# EAGLE design auxshiled1.8 (EAGLE 6.5.0)
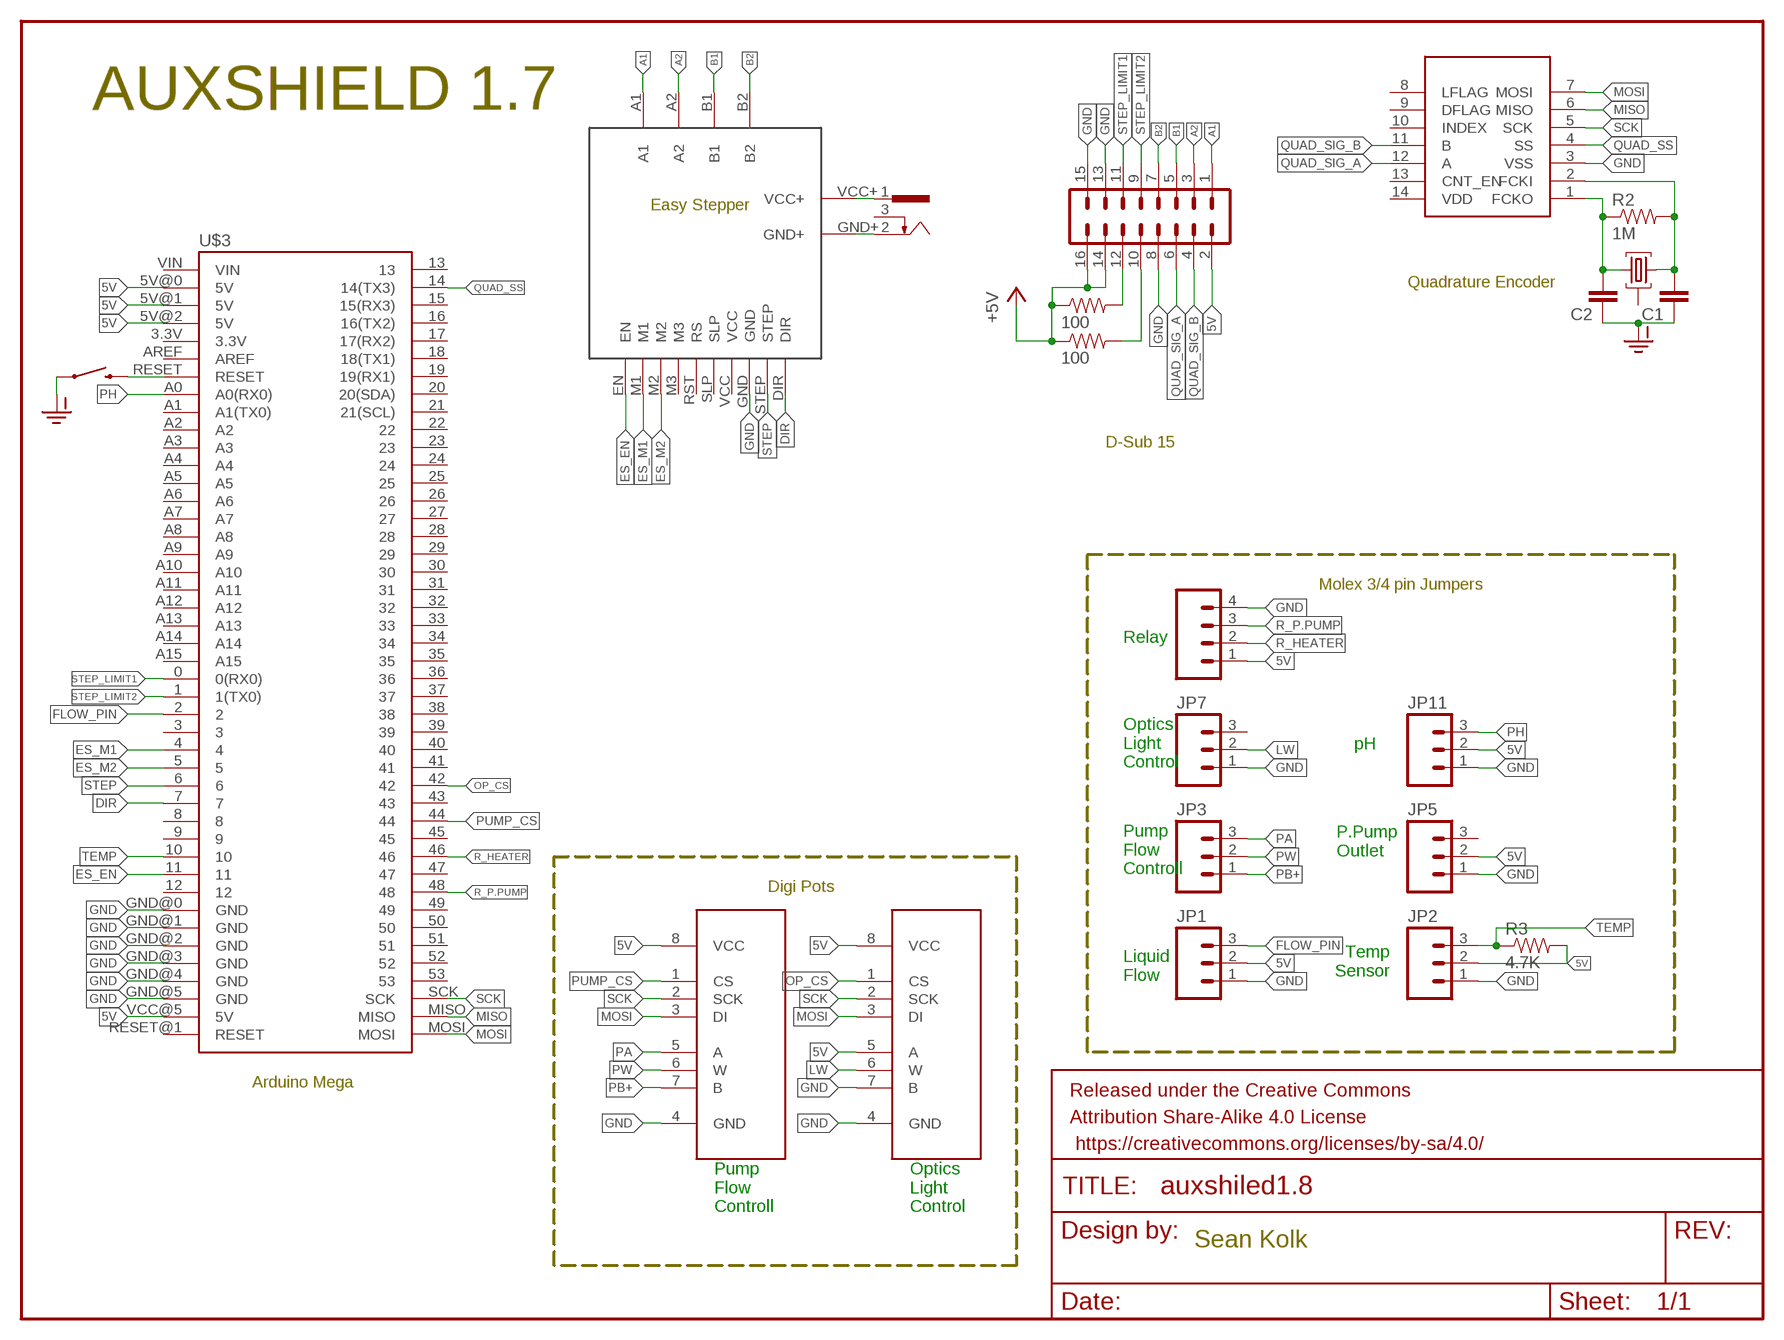
[diagram p0: schematic, sheet 1]

## Parts
C1  0.1UF-50V-20%(PTH)KIT-EZ  [CAP-PTH-SMALL-KIT]
C2  0.1UF-50V-20%(PTH)KIT-EZ  [CAP-PTH-SMALL-KIT]
FRAME1  FRAME-LETTER  [CREATIVE_COMMONS]
JP1  M03POLAR  [MOLEX-1X3]
JP2  M03POLAR  [MOLEX-1X3]
JP3  M03POLAR  [MOLEX-1X3]
JP5  M03POLAR  [MOLEX-1X3]
JP7  M03POLAR  [MOLEX-1X3]
JP11  M03POLAR  [MOLEX-1X3]
PUMPDIGIPOT  MCP41XXXDIL  [DIL-08]
QF2  14M20BHC49T  [HC49U]
R1  100  10OHM-1/4W-5%(PTH)  [AXIAL-0.3]
R2  1M  10OHM-1/4W-5%(PTH)  [AXIAL-0.3]
R3  4.7K  10OHM-1/4W-5%(PTH)  [AXIAL-0.3]
R4  100  10OHM-1/4W-5%(PTH)  [AXIAL-0.3]
RELAY  M04POLAR  [MOLEX-1X4]
S1  SWITCH-MOMENTARY-2PTH_EZ  [TACTILE-PTH-EZ]
U1  MCP41XXXDIL  [DIL-08]
U$1  M08X2  [2X8]
U$2  LS7366R  [SO014]
U$3  ARDUINO-MEGA-V2  [ARDUINO_MEGA-PRO-5V]
U$4  BIG_EASY_DRIVER  [BIG_EASY_DRIVER_PACK]
X1  SCD-014A  [SCD-014-A]

## Nets
5V: JP1.2 JP2.2 JP5.2 JP11.2 PUMPDIGIPOT.8(VCC) R1.P$1 R3.P$2 R4.P$1 RELAY.1 U1.5(A) U1.8(VCC) U$1.2 U$1.14 U$1.16 U$3.5V@0(5V) U$3.5V@1(5V) U$3.5V@2(5V) U$3.VCC@5(5V) ; supply symbol labelled +5V
A1: U$1.1 U$4.A1
A2: U$1.3 U$4.A2
B1: U$1.5 U$4.B1
B2: U$1.7 U$4.B2
DIR: U$3.7 U$4.DIR
ES_EN: U$3.11 U$4.EN
ES_M1: U$3.4 U$4.M1
ES_M2: U$3.5 U$4.M2
FLOW_PIN: JP1.3 U$3.2
GND: C1.1 C2.1 JP1.1 JP2.1 JP5.1 JP7.1 JP11.1 PUMPDIGIPOT.4(GND) RELAY.4 S1.1 U1.4(GND) U1.7(B) U$1.8 U$1.13 U$1.15 U$2.3(VSS) U$3.GND@0(GND) U$3.GND@1(GND) U$3.GND@2(GND) U$3.GND@3(GND) U$3.GND@4(GND) U$3.GND@5(GND) U$4.GND ; supply symbol labelled GND-ISO
LW: JP7.2 U1.6(W)
MISO: U$2.6(MISO) U$3.MISO
MOSI: PUMPDIGIPOT.3(DI) U1.3(DI) U$2.7(MOSI) U$3.MOSI
N$1: U$4.VCC+ X1.1
N$2: U$4.GND+ X1.2
N$4: R1.P$2 U$1.10
N$9: S1.3 U$3.RESET
N$12: C1.2 QF2.3 R2.P$2 U$2.2(FCKI)
N$25: C2.2 QF2.1 R2.P$1 U$2.1(FCKO)
N$33: R4.P$2 U$1.12
OP_CS: U1.1(CS) U$3.42
PA: JP3.3 PUMPDIGIPOT.5(A)
PB+: JP3.1 PUMPDIGIPOT.7(B)
PH: JP11.3 U$3.A0(A0(RX0))
PUMP_CS: PUMPDIGIPOT.1(CS) U$3.44
PW: JP3.2 PUMPDIGIPOT.6(W)
QUAD_SIG_A: U$1.6 U$2.12(A)
QUAD_SIG_B: U$1.4 U$2.11(B)
QUAD_SS: U$2.4(SS) U$3.14(14(TX3))
R_HEATER: RELAY.2 U$3.46
R_P.PUMP: RELAY.3 U$3.48
SCK: PUMPDIGIPOT.2(SCK) U1.2(SCK) U$2.5(SCK) U$3.SCK
STEP: U$3.6 U$4.STEP
STEP_LIMIT1: U$1.11 U$3.0(0(RX0))
STEP_LIMIT2: U$1.9 U$3.1(1(TX0))
TEMP: JP2.3 R3.P$1 U$3.10
Unconnected: JP5.3 JP7.3 QF2.2 U$2.8(LFLAG) U$2.9(DFLAG) U$2.10(INDEX) U$2.13(CNT_EN) U$2.14(VDD) U$3.3 U$3.3.3V U$3.8 U$3.9 U$3.12 U$3.13 U$3.15(15(RX3)) U$3.16(16(TX2)) U$3.17(17(RX2)) U$3.18(18(TX1)) U$3.19(19(RX1)) U$3.20(20(SDA)) U$3.21(21(SCL)) U$3.22 U$3.23 U$3.24 U$3.25 U$3.26 U$3.27 U$3.28 U$3.29 U$3.30 U$3.31 U$3.32 U$3.33 U$3.34 U$3.35 U$3.36 U$3.37 U$3.38 U$3.39 U$3.40 U$3.41 U$3.43 U$3.45 U$3.47 U$3.49 U$3.50 U$3.51 U$3.52 U$3.53 U$3.A1(A1(TX0)) U$3.A2 U$3.A3 U$3.A4 U$3.A5 U$3.A6 U$3.A7 U$3.A8 U$3.A9 U$3.A10 U$3.A11 U$3.A12 U$3.A13 U$3.A14 U$3.A15 U$3.AREF U$3.RESET@1(RESET) U$3.VIN U$4.M3 U$4.RST(RS) U$4.SLP U$4.VCC X1.3

## Notes on the sheet
- AUXSHIELD 1.7
- Easy Stepper
- Quadrature Encoder
- D-Sub 15
- Molex 3/4 pin Jumpers
- Relay
- pH
- Optics
  Light 
  Control
- P.Pump 
  Outlet
- Pump
  Flow
  Controll
- Digi Pots
- Temp
  Sensor
- Liquid 
  Flow
- Arduino Mega
- Pump
  Flow
  Controll
- Optics
  Light
  Control
- Sean Kolk

## Library data of the parts
C1 C2 = SparkFun-Capacitors:0.1UF-50V-20%(PTH): CAP-08370; PROD_ID: CAP-08370
FRAME1 = SparkFun-Aesthetics:FRAME-LETTER: Schematic Frame Standard 8.5x11 US Letter frame
JP1-JP3 JP5 JP7 JP11 = SparkFun-Connectors:M03: Header 3 Standard 3-pin 0.1" header. Use with straight break away headers (SKU : PRT-00116), right angle break away headers (PRT-00553), swiss pins (PRT-00743), machine pins (PRT-00117), and female headers (PRT-00115). Molex polarized connector foot print use with SKU : PRT-08232 with associated crimp pins and housings.
PUMPDIGIPOT U1 = SparkFun-AnalogIC:MCP41XXX: SPI controlled single digital potentiometer by Microchip PID: COM-10613
QF2 = crystal:14M20BHC49T: Monolithic Crystal Filters Source: www.vanlong.com; OC_FARNELL: unknown; OC_NEWARK: unknown
R1-R4 = SparkFun-Resistors:10OHM-1/4W-5%(PTH): RES-10698; PROD_ID: RES-10698; VALUE: 10
RELAY = SparkFun-Connectors:M04: Header 4 Standard 4-pin 0.1" header. Use with straight break away headers (SKU : PRT-00116), right angle break away headers (PRT-00553), swiss pins (PRT-00743), machine pins (PRT-00117), and female headers (PRT-00115). Molex polarized connector foot print use with SKU : PRT-08231 with associated crimp pins and housings. 1MM SMD Version SKU: PRT-10208
S1 = SparkFun-Electromechanical:SWITCH-MOMENTARY-2: Various NO switches- pushbuttons, reed, etc
U$1 = SparkFun-Connectors:M08X2: .1" headers, two rows of 8 each
U$2 = SparkFun-DigitalIC:LS7366R
U$3 = MEGASHIELD2:ARDUINO-MEGA-V2
U$4 = SparkFun-Boards:BIG_EASY_DRIVER
X1 = con-shiua-chyuan:SCD-014A: Power Jack 2.5mm; OC_FARNELL: unknown; OC_NEWARK: unknown

## Board
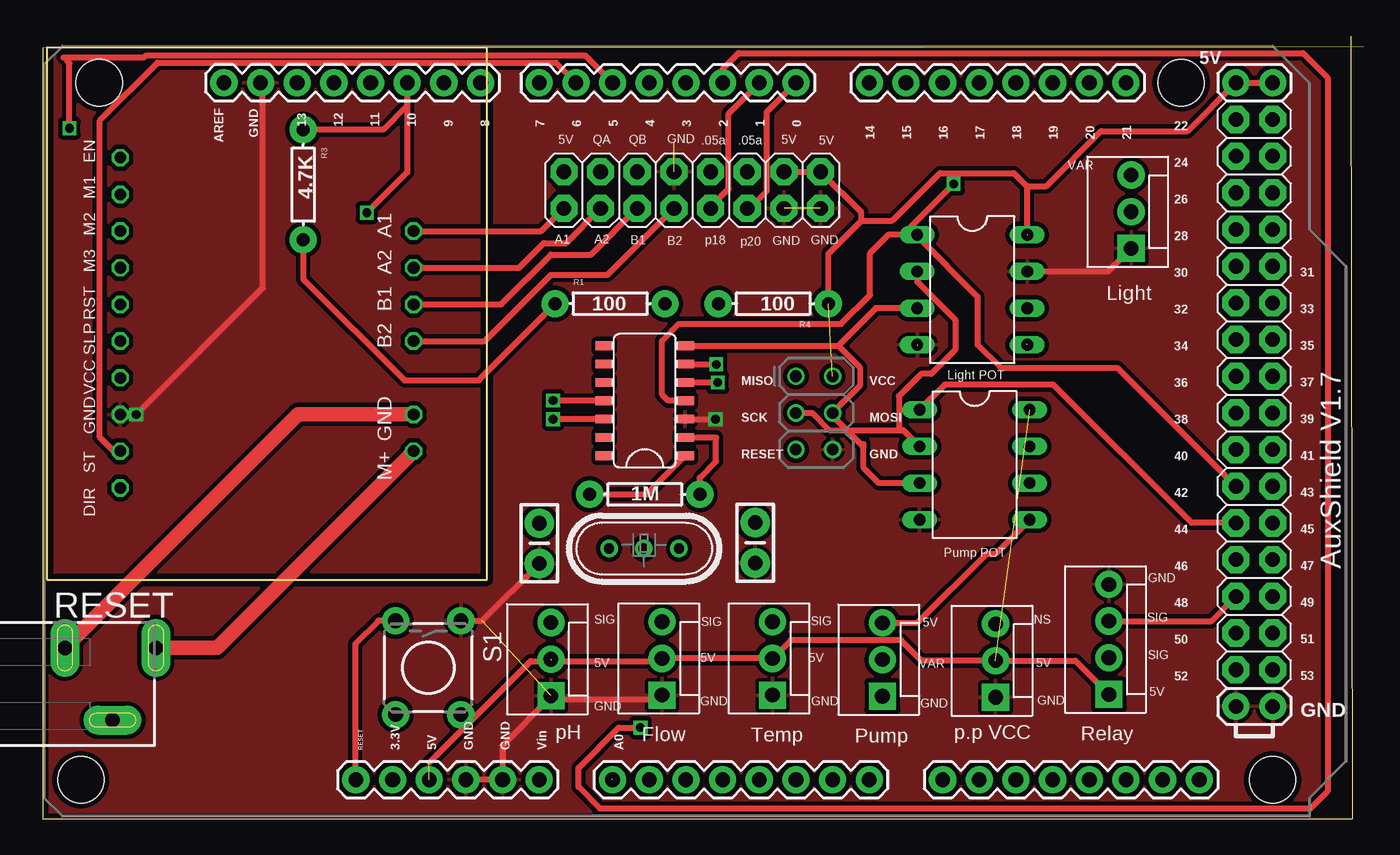
[diagram p1: board, top side]
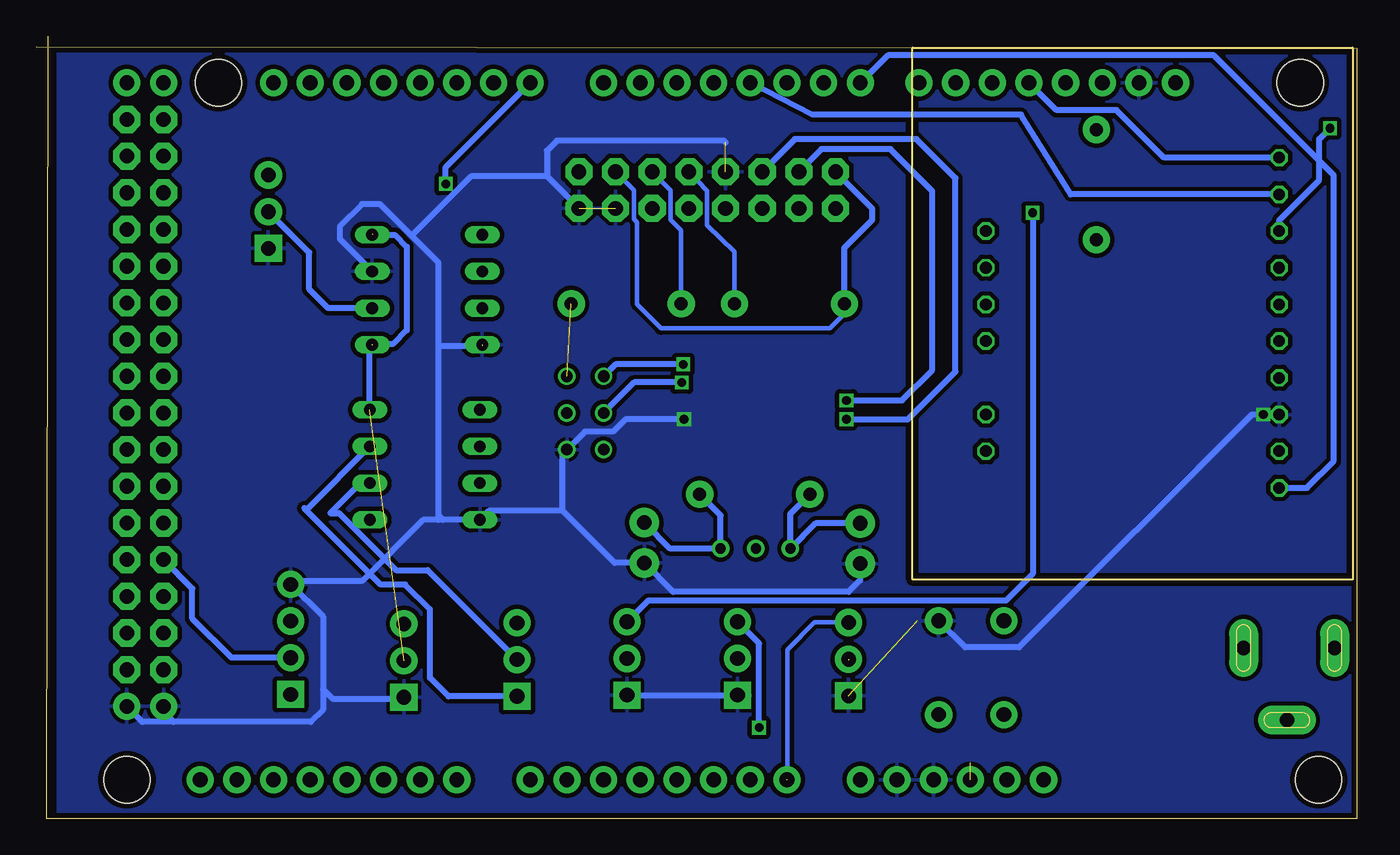
[diagram p2: board, bottom side, seen from below]

Size 91.48 x 54.18 mm. Coordinates in mm from the lower left corner, seen from the top.
Outline: 90.65,54.18 90.75,0 0,0 0,53.33
Outline: 91.48,53.44 0,53.34
Copper layers (1*16): Top 0.0356mm / dielectric 1.5011mm / Bottom 0.0356mm
Design rules "LaenPCBOrder (1)": minimum track width 6mil, minimum drill 13mil, track to track 6mil, track to pad 6mil, pad to pad 6mil, via to via 6mil, smd to smd 6mil, copper to edge 15mil, drill to drill 6mil, minimum pad ring 7mil, minimum via ring 7mil, stop-mask expansion 3mil, vias tented up to drill 0mil, thermal gap 10mil

### Footprints (pad centres in the part's own frame; a part is rotated, then mirrored left to right if it is on the bottom)
CAP-PTH-SMALL-KIT = drill 1.016 pad 2.032: 1 -1.397,0; 2 1.397,0
MOLEX-1X3 = drill 1.016 pad 1.88 square: 1 0,0 | drill 1.016 pad 1.88: 2 2.54,0; 3 5.08,0
DIL-08 = drill 0.813 long: 1 -3.81,-3.81; 2 -1.27,-3.81; 3 1.27,-3.81; 4 3.81,-3.81; 5 3.81,3.81; 6 1.27,3.81; 7 -1.27,3.81; 8 -3.81,3.81
HC49U = drill 0.7 pad 1.2: 1 -2.413,0; 2 -0.027,0; 3 2.413,0
AXIAL-0.3 = drill 0.9 pad 1.88: P$1 -3.81,0; P$2 3.81,0
MOLEX-1X4 = drill 1.016 pad 1.88 square: 1 0,0 | drill 1.016 pad 1.88: 2 2.54,0; 3 5.08,0; 4 7.62,0
TACTILE-PTH-EZ = drill 1.016 pad 1.88: 1 -3.251,2.261; 2 3.251,2.261; 3 -3.251,-2.261; 4 3.251,-2.261
2X8 = drill 1.016 pad 1.88 octagon: 1 0,0; 2 0,2.54; 3 2.54,0; 4 2.54,2.54; 5 5.08,0; 6 5.08,2.54; 7 7.62,0; 8 7.62,2.54; 9 10.16,0; 10 10.16,2.54; 11 12.7,0; 12 12.7,2.54; 13 15.24,0; 14 15.24,2.54; 15 17.78,0; 16 17.78,2.54
SO014 = smd 0.6 x 1.2: 1 -3.175,-2.8; 2 -1.905,-2.8; 3 -0.635,-2.8; 4 0.635,-2.8; 5 1.905,-2.8; 6 3.175,-2.8; 7 4.445,-2.8; 8 4.445,2.8; 9 3.175,2.8; 10 1.905,2.8; 11 0.635,2.8; 12 -0.635,2.8; 13 -1.905,2.8; 14 -3.175,2.8
ARDUINO_MEGA-PRO-5V = drill 1.016 pad 1.88: 0 52.07,50.8; 1 49.53,50.8; 2 46.99,50.8; 3 44.45,50.8; 3.3V 24.13,2.54; 4 41.91,50.8; 5 39.37,50.8; 5V@0 26.67,2.54; 5V@1 82.55,50.8; 5V@2 85.09,50.8; 6 36.83,50.8; 7 34.29,50.8; 8 30.226,50.8; 9 27.686,50.8; 10 25.146,50.8; 11 22.606,50.8; 12 20.066,50.8; 13 17.526,50.8; 14 57.15,50.8; 15 59.69,50.8; 16 62.23,50.8; 17 64.77,50.8; 18 67.31,50.8; 19 69.85,50.8; 20 72.39,50.8; 21 74.93,50.8; A0 39.37,2.54; A1 41.91,2.54; A2 44.45,2.54; A3 46.99,2.54; A4 49.53,2.54; A5 52.07,2.54; A6 54.61,2.54; A7 57.15,2.54; A8 62.23,2.54; A9 64.77,2.54; A10 67.31,2.54; A11 69.85,2.54; A12 72.39,2.54; A13 74.93,2.54; A14 77.47,2.54; A15 80.01,2.54; AREF 12.446,50.8; GND@0 29.21,2.54; GND@1 31.75,2.54; GND@2 82.55,7.62; GND@3 85.09,7.62; GND@4 14.986,50.8; RESET 21.59,2.54; VIN 34.29,2.54 | drill 1.016 pad 1.88 octagon: 22 82.55,48.26; 23 85.09,48.26; 24 82.55,45.72; 25 85.09,45.72; 26 82.55,43.18; 27 85.09,43.18; 28 82.55,40.64; 29 85.09,40.64; 30 82.55,38.1; 31 85.09,38.1; 32 82.55,35.56; 33 85.09,35.56; 34 82.55,33.02; 35 85.09,33.02; 36 82.55,30.48; 37 85.09,30.48; 38 82.55,27.94; 39 85.09,27.94; 40 82.55,25.4; 41 85.09,25.4; 42 82.55,22.86; 43 85.09,22.86; 44 82.55,20.32; 45 85.09,20.32; 46 82.55,17.78; 47 85.09,17.78; 48 82.55,15.24; 49 85.09,15.24; 50 82.55,12.7; 51 85.09,12.7; 52 82.55,10.16; 53 85.09,10.16 | drill 0.8: GND@5 54.61,25.4; MISO 52.07,30.48; MOSI 54.61,27.94; RESET@1 52.07,25.4; SCK 52.07,27.94; VCC@5 54.61,30.48 | hole 3.2: 3.81,50.8; 2.54,2.54; 78.74,50.8; 85.09,2.54
BIG_EASY_DRIVER_PACK = drill 0.8 octagon: A1 -5.08,15.24; A2 -2.54,15.24; B1 0,15.24; B2 2.54,15.24; DIR 12.7,-5.08; EN -10.16,-5.08; GND 7.62,-5.08; GND+ 7.62,15.24; M1 -7.62,-5.08; M2 -5.08,-5.08; M3 -2.54,-5.08; RST 0,-5.08; SLP 2.54,-5.08; STEP 10.16,-5.08; VCC 5.08,-5.08; VCC+ 10.16,15.24
SCD-014-A = drill 1 pad 2 long: 1 -2.5,13.8; 2 -2.5,7.5; 3 2.5,10.8

### Placement (x,y rotation side)
C1  49.35,19.1 90 top
C2  34.4,19.05 90 top
FRAME1  5.1,-14.95 0 top  (outside the outline)
JP1  42.9,8.55 90 top
JP2  50.55,8.55 90 top
JP3  58.16,8.47 90 top
JP5  66,8.4 90 top
JP7  75.39,39.48 90 top
JP11  35.2,8.5 90 top
PUMPDIGIPOT  64.55,24.5 270 top
QF2  41.65,18.7 0 top
R1  39.3,35.65 0 top
R2  41.7,22.45 0 top
R3  18.05,43.9 270 top
R4  50.6,35.65 180 top
RELAY  73.85,8.6 90 top
S1  26.7,10.45 270 top
U1  64.39,36.62 270 top
U$1  36.1,42.25 0 top
U$2  41.7,28.3 90 top
U$3  0.1,0.15 0 top
U$4  10.45,35.6 270 top
X1  -5.96,9.32 270 top

### Tracks (layer width: path | path; a pad name or v marks a point on that pad's centre or on a via)
5V  (6 unrouted)
  Top 0.305: 35.2,10.95 35.25,10.9
  Top 0.406: 26.77,3.87 33.8,10.9 35.25,10.9 42.71,10.9 JP1.2 JP2.2 51.81,12.35 59.45,12.35 60.86,10.94 JP5.2 71.51,10.94 RELAY.1 | R4.P$1 54.41,39.11 56.7,41.4 | 56.7,41.4 56.7,41.97 U$1.16 U$1.14 | 56.7,41.4 58.85,41.4 62.15,44.7 67.25,44.7 68.15,43.8 | 68.15,43.8 68.15,40.47 | R3.P$2 18.05,37.35 25.05,30.35 30.19,30.35 R1.P$1 | 68.15,43.8 69.5,43.8 73.3,47.6 79.3,47.6 U$3.5V@1 U$3.5V@2
  Bottom 0.305: R1.P$1 35.49,34.96 36.5,33.95 48.2,33.95 49.85,35.6 49.85,41.3 50.05,41.5 50.05,43.5 U$1.14
  Bottom 0.406: U1.8 66.62,40.42 65.8,39.6 65.8,33.8 66.75,32.85 68.15,32.85 | 35.34,35.5 R1.P$1 35.49,39.51 33.55,41.45 33.55,42.24 U$1.2 | PUMPDIGIPOT.8 68.36,32.64 U1.5
A1
  Top 0.406: U$4.A1 34.53,40.68 U$1.1
A2
  Top 0.406: U$4.A2 32.99,38.14 34.7,39.85 36.24,39.85 U$1.3
B1
  Top 0.406: U$4.B1 31.75,35.6 35.2,39.05 37.98,39.05 U$1.5
B2
  Top 0.406: U$4.B2 30.61,33.06 35.2,37.65 39.12,37.65 U$1.7
DIR
  Bottom 0.406: U$4.DIR 3.45,22.9 1.6,24.75 1.6,44.55 9.9,52.85 32.49,52.85 U$3.7
ES_EN
  Bottom 0.406: U$4.EN 13.36,45.76 16.65,49.05 20.81,49.05 U$3.11
ES_M1
  Bottom 0.406: U$4.M1 19.82,43.22 23.25,48.75 37.71,48.75 U$3.4
ES_M2  (via drill 0.6)
  Top 0.406: v1.85,47.8 1.85,52.3 1.45,52.7 7,52.7 7.15,52.85 37.57,52.85 U$3.5
  Bottom 0.406: U$4.M2 5.37,41.43 2.6,44.2 2.6,47.05 v1.85,47.8
FLOW_PIN  (via drill 0.6)
  Top 0.406: U$3.2 47.09,51.89 48.2,53 87.3,53 89,51.3 89,1.9 87.8,0.7 38.6,0.7 37.1,2.2 37.1,3.5 39.9,6.3 v41.4,6.3
  Bottom 0.406: v41.4,6.3 41.4,12.13 JP1.3
GND  (via drill 0.6)  (6 unrouted)
  Top 0.305: 35.05,8.25 35.05,8.35
  Top 0.406: JP1.1 42.6,8.25 35.05,8.25 31.85,5.05 U$3.GND@1 U$3.GND@0 | U1.7 73.8,37.88 JP7.1 | U$2.3 46.59,27.66 v46.6,27.65 | U$4.GND v6.48,27.98 15.25,36.75 15.25,50.79 U$3.GND@4 | S1.1 30.45,13.7 C2.1
  Bottom 0.406: 63.6,21 63.6,20.69 64.66,20.69 68.9,16.45 73.83,16.45 73.83,16.23 71.6,14 71.6,8.95 | 63.6,21 63.6,32.75 | 63.6,32.75 60.58,32.75 | 63.6,32.75 63.6,38.5 65.45,40.35 | 65.45,40.35 67.65,42.55 68.9,42.55 70.45,41 70.45,40.14 U1.7 | 43.72,46.82 43.85,46.95 55.4,46.95 56.1,46.25 56.1,44.47 | 56.1,44.47 U$1.15 | v46.6,27.65 50.65,27.65 51.5,26.8 53.46,26.8 U$3.GND@5 55,25.26 55,21.3 | C2.1 34.4,16.5 35.2,15.7 47.35,15.7 C1.1 51.4,17.7 55,21.3 | 56.1,44.47 61.33,44.47 65.45,40.35 | 55,21.3 60.13,21.3 PUMPDIGIPOT.4 63.29,20.69 63.6,21 | 71.6,8.95 70.95,8.3 66.1,8.3 JP5.1 | 71.6,8.95 71.6,7.55 72.45,6.7 81.95,6.7 | 81.95,6.7 84.12,6.7 U$3.GND@3 | U$3.GND@2 82.65,7.4 81.95,6.7 | JP2.1 JP1.1 | JP11.1 35.05,8.35 | v6.48,27.98 7.27,27.98 23.4,11.85 27.11,11.85 S1.1
  pour Bottom (isolate 0.305, rank 2): 0.3,0.3 89.95,0.3 89.95,53.65 0.3,53.65
  pour Top (isolate 0.305, rank 2): 0.2,0.25 89.7,0.25 89.7,53.65 0.2,53.65
LW
  Bottom 0.406: U1.6 71.25,35.34 72.55,36.65 72.55,39.18 JP7.2
MISO  (via drill 0.6)
  Top 0.406: U$2.6 46.62,31.48 v46.65,31.45
  Bottom 0.406: v46.65,31.45 51.35,31.45 U$3.MISO
MOSI
  Top 0.406: PUMPDIGIPOT.3 57.92,23.23 56.85,24.3 56.85,25.75 | 56.85,25.75 56.85,25.95 | U$2.7 55.1,32.74 | 55.1,32.74 56.6,31.25 56.6,29.98 U$3.MOSI 54.71,27.89 56.85,25.75 | U1.3 57.7,35.34 55.1,32.74
N$1
  Top 1.016: X1.1 12.07,11.82 U$4.VCC+
N$2
  Top 1.016: X1.2 1.54,11.84 17.7,28 25.67,28 U$4.GND+
N$4
  Bottom 0.305: R1.P$2 43.11,39.26 45,41.1 45,43.48 U$1.10
N$9
  Top 0.406: S1.3 23.25,13.7 21.65,12.1 21.65,2.73 U$3.RESET
N$12
  Top 0.406: U$2.2 46.65,26.39 | 46.65,26.39 46.65,26.4 | R2.P$2 45.51,23.61 46.65,24.75 46.65,26.39
  Bottom 0.406: C1.2 47.55,18.7 QF2.3 44.06,21 R2.P$2
N$25
  Top 0.406: R2.P$1 41.83,22.45 U$2.1
  Bottom 0.406: C2.2 37.49,20.45 QF2.1 39.24,21.1 R2.P$1
N$33
  Bottom 0.305: R4.P$2 46.79,40.74 47.55,41.45 47.55,43.49 U$1.12
OP_CS
  Top 0.406: U1.1 60.58,40.33 64.75,36.15 64.75,32.8 66.35,31.2 74.45,31.2 83.1,22.55 83.1,22.56 U$3.42
PA
  Top 0.406: JP3.3 60.6,13.55 65.4,18.35 66.02,18.35 PUMPDIGIPOT.5
PB+
  Bottom 0.406: JP3.1 62.92,8.47 64.2,9.75 64.2,14.5 65.9,16.2 67.6,16.2 72.9,21.5 72.63,21.5 PUMPDIGIPOT.7
PH  (1 unrouted)
  Bottom 0.305: JP11.3 37.57,13.58 39.45,11.7 39.45,2.71
PUMP_CS
  Top 0.406: U$3.44 79.58,20.47 70,30.05 62.48,30.05 PUMPDIGIPOT.1
PW
  Bottom 0.406: PUMPDIGIPOT.6 69.02,23.23 71.1,21.15 70.5,21.15 66.55,17.2 64.35,17.2 JP3.2
QUAD_SIG_A  (via drill 0.6)
  Top 0.406: U$2.12 35.37,27.66 v35.35,27.65
  Bottom 0.406: v35.35,27.65 31.1,27.65 27.8,30.95 27.8,44.35 30.5,47.05 38.92,47.05 U$1.6
QUAD_SIG_B  (via drill 0.6)
  Top 0.406: U$2.11 35.37,28.93 v35.35,28.95
  Bottom 0.406: v35.35,28.95 31.5,28.95 29.4,31.05 29.4,43.45 32.3,46.35 37.08,46.35 U$1.4
QUAD_SS  (via drill 0.6)
  Top 0.406: U$2.4 43.31,28.93 42.9,29.35 42.9,33.1 44.05,34.25 55.3,34.25 57.3,36.25 57.3,39.15 58.6,40.45 59.6,40.45 v63.1,43.95
  Bottom 0.406: v63.1,43.95 63.1,45.1 U$3.14
R_HEATER
  Bottom 0.406: RELAY.2 77.94,11.14 80.65,13.85 80.65,15.93 U$3.46
R_P.PUMP
  Top 0.406: RELAY.3 80.94,13.68 U$3.48
SCK  (via drill 0.6)
  Top 0.406: U$2.5 v46.74,30.2 v46.75,30.2 | U$3.SCK 53.31,28.09 54.5,26.9 59.3,26.9 | 59.3,26.9 59.61,26.9 PUMPDIGIPOT.2 | U1.2 60.58,37.17 63.2,34.55 63.2,32.45 61.55,30.8 60.85,30.8 59.3,29.25 59.3,26.9
  Bottom 0.406: v46.75,30.2 50.06,30.2 U$3.SCK
STEP
  Top 0.406: U$4.STEP 4.91,25.44 3.95,26.4 3.95,48.35 7.95,52.35 35.53,52.35 U$3.6
STEP_LIMIT1
  Top 0.406: U$1.11 48.95,42.25 50.15,43.45 50.15,48.93 U$3.0
STEP_LIMIT2
  Top 0.406: U$1.9 46.26,42.36 47.5,43.6 47.5,48.82 U$3.1
TEMP  (via drill 0.6)
  Top 0.406: R3.P$1 23.6,47.7 25.25,49.35 U$3.10 25.25,44.75 v22.45,41.95
  Bottom 0.406: v22.45,41.95 22.45,16.95 24.3,15.1 49.08,15.1 JP2.3

### Text on the board
tPlace: 5V | QA | QB | GND | .05a | .05a | 5V | 5V | VAR | A1 | A2 | B1 | B2 | p18 | p20 | GND | GND | Light | Light POT | Pump POT | AuxShield V1.7 | GND | RESET | SIG | SIG | SIG | SIG | 5V | NS | 5V | 5V | SIG | 5V | VAR | 5V | GND | GND | GND | GND | 5V | GND | pH | p.p VCC | Flow | Temp | Pump | Relay
DrillLegend_01-16: 01-16